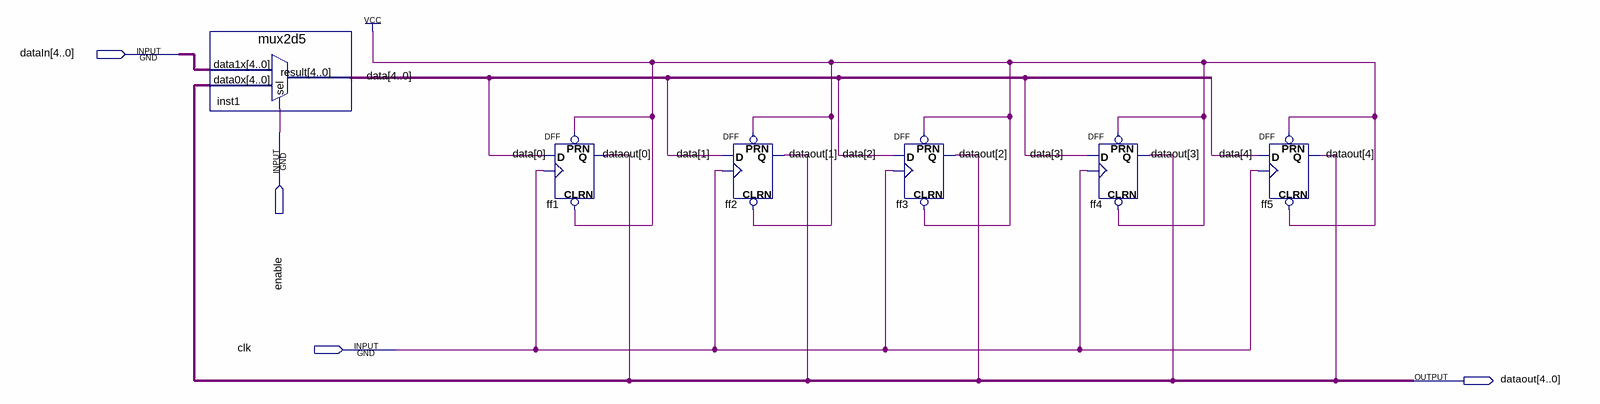
[diagram p0: schematic sheet]
// Quartus schematic register5.bdf as structural Verilog: 6 symbols, 4 pins
module register5 (
  input  [4:0] dataIn,
  input  enable,
  input  clk,
  output [4:0] dataout
);

  wire [4:0] data;

  mux2d5 inst1 (.data1x(dataIn), .data0x(dataout), .sel(enable), .result(data));
  DFF ff1 (.CLRN(1'b1), .CLK(clk), .D(data[0]), .PRN(1'b1), .Q(dataout[0]));
  DFF ff2 (.CLRN(1'b1), .CLK(clk), .D(data[1]), .PRN(1'b1), .Q(dataout[1]));
  DFF ff3 (.CLRN(1'b1), .CLK(clk), .D(data[2]), .PRN(1'b1), .Q(dataout[2]));
  DFF ff4 (.CLRN(1'b1), .CLK(clk), .D(data[3]), .PRN(1'b1), .Q(dataout[3]));
  DFF ff5 (.CLRN(1'b1), .CLK(clk), .D(data[4]), .PRN(1'b1), .Q(dataout[4]));
endmodule
